# EasyEDA Pro project OMO - WayBox.eprj, board PCB1
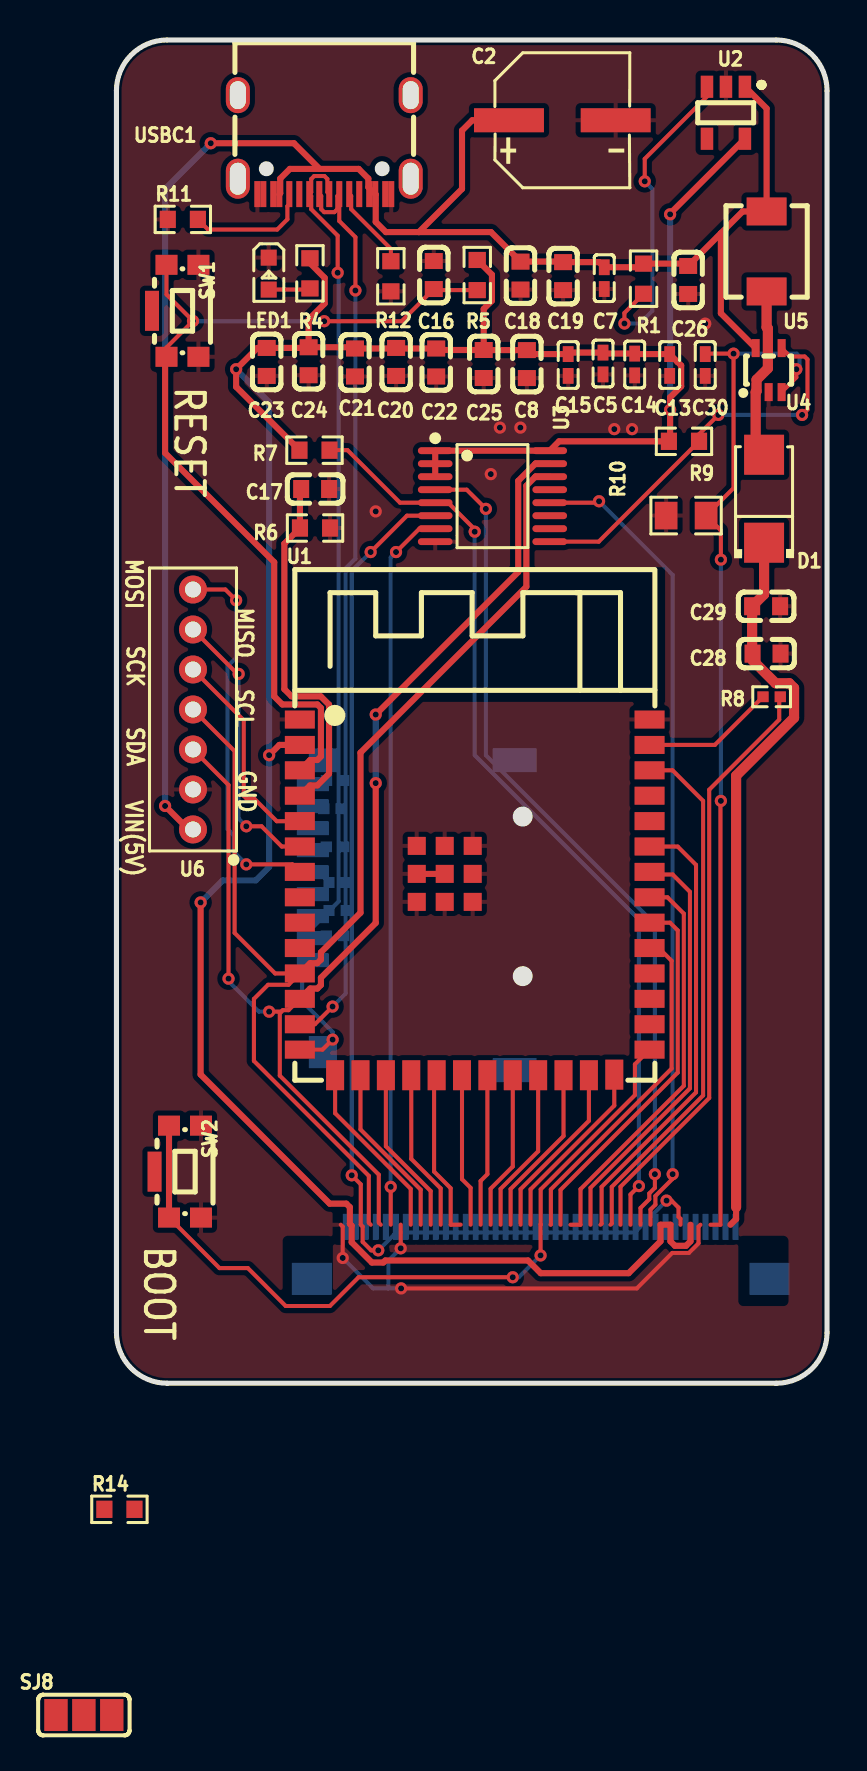
[diagram p2: board, top side]
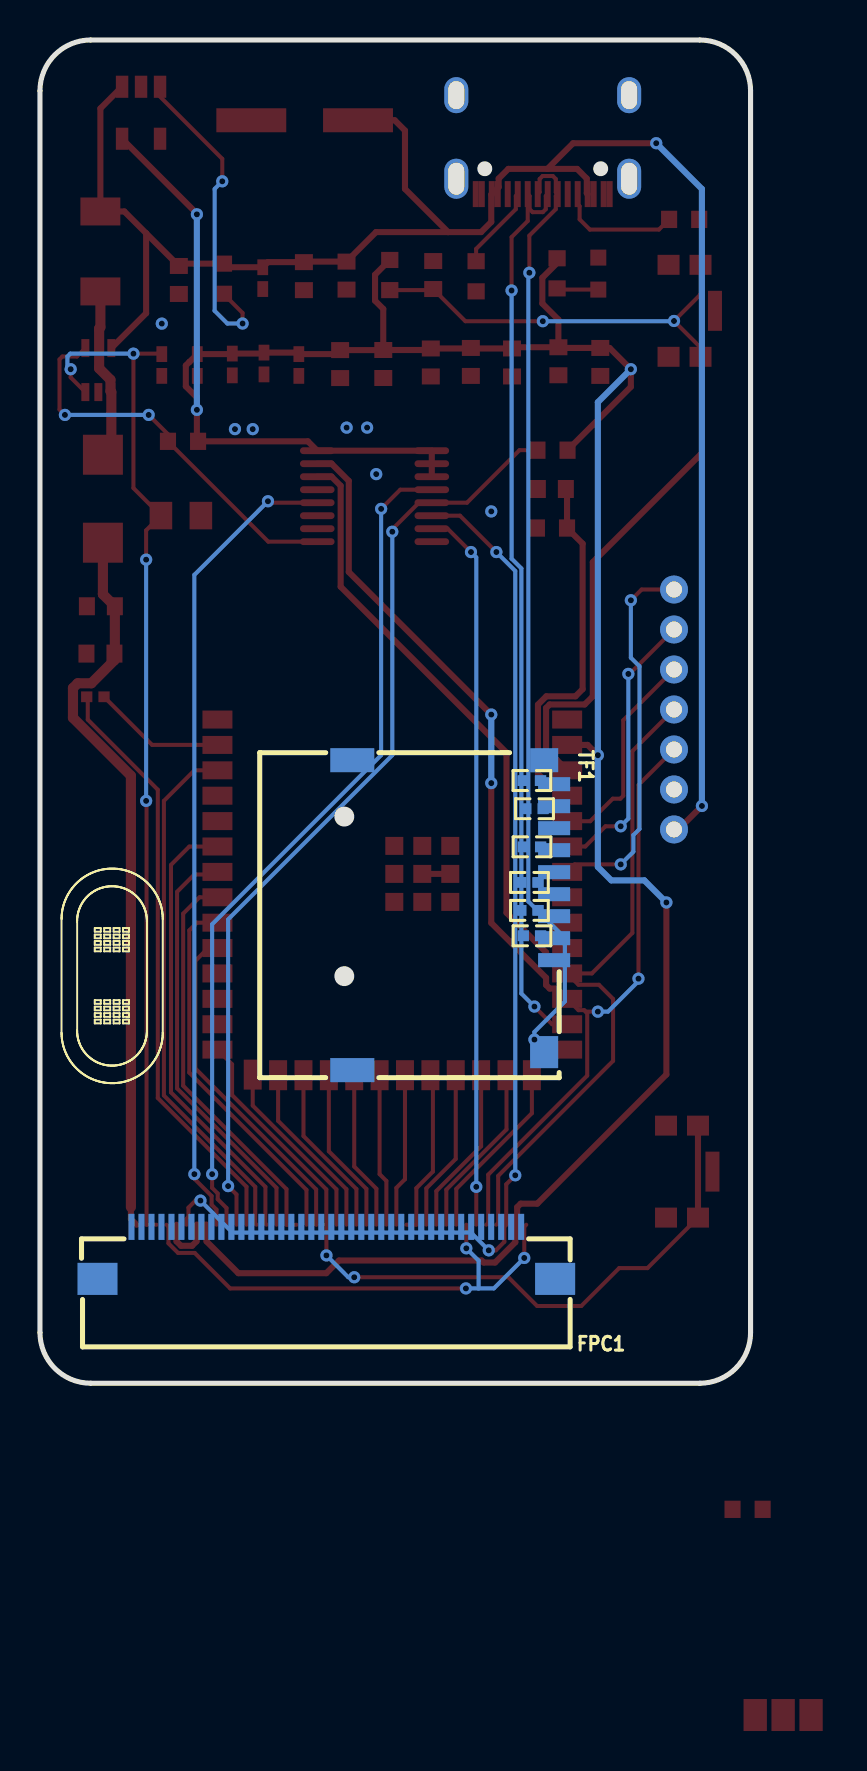
[diagram p3: board, bottom side, seen from below]

Outline 35.56 x 67.18 mm; copper layers: Top Layer, Bottom Layer. Coordinates in mm from the lower left corner of the outline.
Outline path: 0,64.64 0,2.54 arc(0.74,0.74) 2.54,0 33.02,0 arc(34.82,0.74) 35.56,2.54 35.56,64.64 arc(34.82,66.44) 33.02,67.18 2.54,67.18 arc(0.74,66.44) 0,64.64
Stack: Top Layer 0.035mm / Dielectric1 1.51mm FR4 er 4.5 / Bottom Layer 0.035mm

## Design rules (mm)
template: JLCPCB Capability(Two Layers Board)
spacing copperThickness1oz (default): track to track 0.102, other pairs 0.152 to 0.3
spacing copperThickness2oz: track to track 0.203, other pairs 0.152 to 0.3
track width copperThickness1oz (default): min 0.127, default 0.254, max 2.54
track width copperThickness2oz: min 0.203, default 0.254, max 2.54
differential pair differentialPair (default): width min 0.127, default 0.254, max 2.54; gap min 0.152, default 0.152
via viaSize (default): diameter min 0.5, default 0.61, max 10; hole min 0.3, default 0.305, max 6.3

## Placement (name value [footprint] x y rotation side)
C2  220uF  [CAP-SMD_BD6.3-L6.6-W6.6-LS7.2-FD]  22.31 63.17 0 top
C5  100nF  [C0402]  24.35 51 270 top
C7  100nF  [C0402]  24.41 55.27 270 top
C8  1uF  [C0603]  20.54 50.97 270 top
C13  100nF  [C0402]  27.69 50.93 270 top
C14  100nF  [C0402]  25.94 50.95 270 top
C15  100nF  [C0402]  22.61 50.93 270 top
C16  1uF  [C0603]  15.88 55.43 90 top
C17  1uF  [C0603]  9.94 44.73 0 top
C18  10uF  [C0603]  20.22 55.4 270 top
C19  10uF  [C0603]  22.35 55.37 270 top
C20  10uF  [C0603]  14 51.08 270 top
C21  10uF  [C0603]  11.94 51.05 270 top
C22  10uF  [C0603]  16 51.05 270 top
C23  10uF  [C0603]  7.52 51.08 270 top
C24  10uF  [C0603]  9.62 51.12 270 top
C25  10uF  [C0603]  18.38 50.98 270 top
C26  10uF  [C0603]  28.61 55.18 270 top
C28  1uF  [C0603]  32.53 36.49 0 top
C29  1uF  [C0603]  32.51 38.86 0 top
C30  100nF  [C0402]  29.46 50.93 90 top
D1  SS34  [SMA_L4.3-W2.6-LS5.2-RD]  32.41 44.24 90 top
FPC1  AFC01-S40FCA-00  [FPC-SMD_P0.50-40P_FGS-XJ-H2.0]  21.23 6.52 0 bottom
LED1  KT-0603G  [LED0603-RD]  7.62 55.5 270 top
R1  100kΩ  [R0603]  26.38 55.24 270 top
R4  10kΩ  [R0603]  9.68 55.51 90 top
R5  10kΩ  [R0603]  18.06 55.43 90 top
R6  1MΩ  [R0603]  9.94 42.77 180 top
R7  10kΩ  [R0603]  9.91 46.67 180 top
R8  100Ω  [R0402]  32.79 34.33 0 top
R9  10kΩ  [R0603]  28.4 47.11 180 top
R10  8.2Ω  [R0805]  28.51 43.4 0 top
R11  5.1kΩ  [R0603]  3.32 58.21 0 top
R12  5.1kΩ  [R0603]  13.73 55.36 270 top
R13  47kΩ  [R0402]  10.94 30.14 0 bottom
R14  10kΩ  [R0603]  0.15 -6.31 0 top
R15  47kΩ  [R0402]  10.81 28.73 0 bottom
R16  47kΩ  [R0402]  10.94 26.83 0 bottom
R17  47kΩ  [R0402]  11.07 25.05 0 bottom
R18  47kΩ  [R0402]  10.94 22.38 0 bottom
R19  47kΩ  [R0402]  11.07 23.65 0 bottom
SJ8  SOLDERJUMPER_2WAY  [SOLDERJUMPER_2WAY_OPEN_NOPASTE]  -1.63 -16.59 0 top
SW1  KMR221GLFS  [KEY-SMD_KMR2XXGXXX]  2.94 53.64 90 top
SW2  KMR221GLFS  [KEY-SMD_KMR2XXGXXX]  3.07 10.58 90 top
TF1  TF-CARD H1.8  [TF-SMD_TF-CARD-H1.8]  14.88 23.41 270 bottom
U1  ESP32-S3-WROOM-1-N16R8  [WIRELM-SMD_ESP32-S3-WROOM-1]  17.93 24.3 0 top
U2  AP2112K-3.3TRG1  [SOT-25-5_L2.9-W1.6-P0.95-LS2.8-BL]  30.5 63.54 180 top
U3  PCA9554PW,118  [TSSOP-16_L5.0-W4.4-P0.65-LS6.4-BL]  18.82 44.37 270 top
U4  TPS61169DCKR  [SC-70-5_L2.1-W1.3-P0.65-LS2.1-BR]  32.64 50.67 270 top
U5  6.8uH  [IND-SMD_L4.5-W4.1_TMPC0412HP]  32.54 56.61 90 top
U6  MF200V-11-07-0740  [CONN-TH_MF200V-11-07-0740]  3.83 33.7 90 top
USBC1  TYPE-C-31-M-12  [USB-C_SMD-TYPE-C-31-M-12]  10.4 61.95 180 top

## Footprints (pads in the part's own frame, mm; a bottom-side part is the same pattern mirrored in y, then rotated)
C0402
  rect 0.79x0.54 smd: 1(-0.545,0) 2(0.545,0)
C0603
  rect 0.8x0.9 smd: 1(-0.7,0) 2(0.7,0)
CAP-SMD_BD6.3-L6.6-W6.6-LS7.2-FD
  rect 3.5x1.2 smd: 1(-2.67,0) 2(2.67,0)
CONN-TH_MF200V-11-07-0740
  round 1.4 hole 0.8: 1(-6,0) 2(-4,0) 3(-2,0) 4(0,0) 5(2,0) 6(4,0) 7(6,0)
FPC-SMD_P0.50-40P_FGS-XJ-H2.0
  rect 0.3x1.3 smd: 1(9.75,-1.3) 2(9.25,-1.3) 3(8.75,-1.3) 4(8.25,-1.3) 5(7.75,-1.3) 6(7.25,-1.3) 7(6.75,-1.3) 8(6.25,-1.3) 9(5.75,-1.3) 10(5.25,-1.3) 11(4.75,-1.3) 12(4.25,-1.3) 13(3.75,-1.3) 14(3.25,-1.3) 15(2.75,-1.3) 16(2.25,-1.3) 17(1.75,-1.3) 18(1.25,-1.3) 19(0.75,-1.3) 20(0.25,-1.3) 21(-0.25,-1.3) 22(-0.75,-1.3) 23(-1.25,-1.3) 24(-1.75,-1.3) 25(-2.25,-1.3) 26(-2.75,-1.3) 27(-3.25,-1.3) 28(-3.75,-1.3) 29(-4.25,-1.3) 30(-4.75,-1.3) 31(-5.25,-1.3) 32(-5.75,-1.3) 33(-6.25,-1.3) 34(-6.75,-1.3) 35(-7.25,-1.3) 36(-7.75,-1.3) 37(-8.25,-1.3) 38(-8.75,-1.3) 39(-9.25,-1.3) 40(-9.75,-1.3)
  rect 2x1.6 smd: 41(-11.45,1.3) 42(11.45,1.3)
IND-SMD_L4.5-W4.1_TMPC0412HP
  rect 1.4x2 smd: 1(-2,0) 2(2,0)
KEY-SMD_KMR2XXGXXX
  rect 1x1.1 smd: 1(-2.3,0.438) 2(2.3,0.438) 3(-2.3,-1.162) 4(2.3,-1.162)
  rect 2x0.7 smd: 5(0,1.162)
LED0603-RD
  rect 0.8x0.8 smd: 1(-0.799,0) 2(0.799,0)
R0402
  rect 0.566x0.54 smd: 1(-0.433,0) 2(0.433,0)
R0603
  rect 0.806x0.864 smd: 1(-0.753,0) 2(0.753,0)
R0805
  rect 1.133x1.377 smd: 1(-1,0) 2(1,0)
SC-70-5_L2.1-W1.3-P0.65-LS2.1-BR
  rect 0.9x0.4 smd: 1(1.1,-0.65) 2(1.1,0) 3(1.1,0.65) 4(-1.1,0.65) 5(-1.1,-0.65)
SMA_L4.3-W2.6-LS5.2-RD
  rect 2x2 smd: 1(-2.2,0) 2(2.2,0)
SOLDERJUMPER_2WAY_OPEN_NOPASTE
  rect 1.169x1.6 smd: 1(-1.397,0) 2(0,0) 3(1.397,0)
SOT-25-5_L2.9-W1.6-P0.95-LS2.8-BL
  rect 0.623x1.105 smd: 1(-0.95,-1.3) 2(-0.001,-1.3) 3(0.95,-1.3) 4(0.95,1.3) 5(-0.95,1.3)
TF-SMD_TF-CARD-H1.8
  rect 0.7x1.6 smd: 1(2.25,5.05) 2(1.15,5.05) 3(0.05,5.05) 4(-1.05,5.05) 5(-2.15,5.05) 6(-3.25,5.05) 7(-4.35,5.05) 8(-5.45,5.05) 9(-6.55,5.05)
  rect 1.2x1.4 smd: 10(-7.747,4.55)
  rect 1.2x2.2 smd: 11(-7.75,-5.05) 12(7.75,-5.05)
  rect 1.6x1.4 smd: 13(6.85,4.55)
TSSOP-16_L5.0-W4.4-P0.65-LS6.4-BL
  oval 0.343x1.732 smd: 1(-2.275,-2.866) 2(-1.625,-2.866) 3(-0.975,-2.866) 4(-0.325,-2.866) 5(0.325,-2.866) 6(0.975,-2.866) 7(1.625,-2.866) 8(2.275,-2.866) 9(2.275,2.866) 10(1.625,2.866) 11(0.975,2.866) 12(0.325,2.866) 13(-0.325,2.866) 14(-0.975,2.866) 15(-1.625,2.866) 16(-2.275,2.866)
USB-C_SMD-TYPE-C-31-M-12
  oval 1.2x2 hole 0.8x1.6: 0(-4.325,1.706) 1(4.325,1.706)
  oval 1.2x1.8 hole 0.8x1.4: 2(4.325,-2.474) 3(-4.325,-2.474)
  rect 0.3x1.3 smd: A1(-3.35,2.474) A4(-2.55,2.474) A5(-1.25,2.474) A6(-0.25,2.474) A7(0.25,2.474) A8(1.25,2.474) A9(2.55,2.474) A12(3.35,2.474) B1(3.05,2.474) B4(2.25,2.474) B5(1.75,2.474) B6(0.75,2.474) B7(-0.75,2.474) B8(-1.75,2.474) B9(-2.25,2.474) B12(-3.05,2.474)
WIRELM-SMD_ESP32-S3-WROOM-1
  rect 1.5x0.9 smd: 1(-8.75,8.895) 2(-8.75,7.625) 3(-8.75,6.355) 4(-8.75,5.085) 5(-8.75,3.815) 6(-8.75,2.545) 7(-8.75,1.275) 8(-8.75,0.005) 9(-8.75,-1.265) 10(-8.75,-2.535) 11(-8.75,-3.805) 12(-8.75,-5.075) 13(-8.75,-6.345) 14(-8.75,-7.615) 27(8.75,-7.615) 28(8.75,-6.345) 29(8.75,-5.075) 30(8.75,-3.805) 31(8.75,-2.535) 32(8.75,-1.265) 33(8.75,0.005) 34(8.75,1.275) 35(8.75,2.545) 36(8.75,3.815) 37(8.75,5.085) 38(8.75,6.355) 39(8.75,7.625) 40(8.75,8.895)
  rect 0.9x1.5 smd: 15(-6.985,-8.895) 16(-5.715,-8.895) 17(-4.445,-8.895) 18(-3.175,-8.895) 19(-1.905,-8.895) 20(-0.635,-8.895) 21(0.635,-8.895) 22(1.905,-8.895) 23(3.175,-8.895) 24(4.445,-8.895) 25(5.715,-8.895) 26(6.985,-8.865)
  rect 0.9x0.9 smd: 41(-2.9,2.575) 41(-2.9,1.175) 41(-2.9,-0.225) 41(-1.5,2.575) 41(-1.5,1.175) 41(-1.5,-0.225) 41(-0.1,2.575) 41(-0.1,1.175) 41(-0.1,-0.225)

## Nets
As in the schematic, except:
3V3: C5.1 C8.1 C13.1 C14.1 C15.1 C20.1 C21.1 C22.1 C23.1 C24.1 C25.1 FPC1.5 FPC1.7 FPC1.8 FPC1.39 R4.2 R5.2 R7.2 R9.2 R13.1 R14.2 R15.1 R16.1 R17.1 R18.1 R19.1 TF1.4 U1.2 U2.5 U3.1 U3.2 U3.3 U3.16
GND: C2.2 C5.2 C7.2 C8.2 C13.2 C14.2 C15.2 C16.2 C17.2 C18.2 C19.2 C20.2 C21.2 C22.2 C23.2 C24.2 C25.2 C26.2 C28.2 C29.2 C30.1 FPC1.4 FPC1.34 FPC1.40 LED1.1 R6.1 R10.1 R11.1 R12.2 SW1.3 SW1.4 SW2.3 SW2.4 TF1.6 TF1.10 TF1.11 TF1.12 TF1.13 U1.1 U1.40 U1.41 U2.2 U3.8 U4.2 U6.2 USBC1.A1 USBC1.A12 USBC1.B1 USBC1.B12

Pads without a net: FPC1 41 42; SJ8 1 2 3; SW1 5; SW2 5; TF1 9; U1 28 29 30 36 37; U2 4; U3 10 11 13; USBC1 0 1 2 3 A8 B8

## Via types
v1: diameter 0.61, hole 0.305, Top Layer to Bottom Layer, 53 vias

## Routing (per net, layer and track width the routed paths; a pad name or vN(x,y) marks a point on that pad's centre or on a via; arc(x,y) is an arc through that point)
3V3: length 144.1
  Top Layer w0.305: C25.1 18.38,51.67 C8.1 20.74,51.47 C15.1 22.68,51.55 C5.1 24.4,51.5 C14.1 25.96,51.47 C13.1 28.08,51.08 28.08,51.08 28.26,50.9 28.26,49.86 27.71,49.31 v1(27.71,48.68) 27.71,47.17 R9.2 22.15,47.11 U3.16 U3.1 U3.2 U3.3 ; C25.1 18.38,53.73 18.79,54.14 18.79,55.44 18.06,56.18 ; C25.1 16.08,51.68 C22.1 14.02,51.75 C20.1 13.97,51.75 C21.1 11.88,51.82 C24.1 ; 28.73,7.93 28.73,7.1 28.5,6.87 27.95,6.87 27.73,7.1 27.73,7.93 27.23,7.93 27.23,7.1 25.63,5.5 21.23,5.5 20.6,6.14 13.46,6.14 13.35,6.04 12.79,6.04 11.77,7.05 11.77,7.88 11.68,7.97 11.68,8.8 11.5,8.98 10.67,8.98 4.21,15.44 v1(4.21,24.05) ; C24.1 9.58,51.78 C23.1 7.05,51.78 v1(5.99,50.72) 5.99,49.83 R7.2 ; C24.1 9.62,53.2 10.42,54 10.42,55.29 9.68,56.02 R4.2 ; v1(27.71,58.46) 27.71,58.5 U2.5 ; v1(7.64,31.41) 8.15,31.93 U1.2
  Bottom Layer w0.305: v1(5.99,50.72) 7.64,49.07 v1(7.64,31.41) 7.64,25.82 6.97,25.15 5.32,25.15 v1(4.21,24.05) ; v1(27.71,58.46) v1(27.71,48.68)
+5V: length 93.3
  Top Layer w0.305: 30.25,57.52 C26.1 28.49,56 R1.1 26.2,55.82 24.41,55.82 24.16,56.07 C19.1 22.32,56.1 C18.1 18.74,57.57 15.13,57.57 ; 30.25,57.52 31.34,58.61 U5.2 32.54,63.76 U2.1 ; 30.25,57.52 30.25,53.51 U4.5 ; 15.13,57.57 13.48,57.57 12.98,58.08 12.98,59.45 USBC1.A4 12.61,59.82 12.61,60.25 12.12,60.73 10.17,60.73 ; 15.13,57.57 17.29,59.73 17.29,62.65 17.81,63.17 C2.1 ; USBC1.B4 8.2,59.52 8.2,60.25 8.68,60.73 10.17,60.73 ; 10.17,60.73 8.88,62.02 v1(4.72,62.02) ; v1(2.43,28.87) 3.61,27.7 U6.1
  Bottom Layer w0.305: v1(4.72,62.02) 2.43,59.73 v1(2.43,28.87)
+24V: length 36.9
  Top Layer w0.305: 30.73,7.93 31.01,8.21 31.01,8.81
  Top Layer w0.508: 31.01,8.81 31.01,30.38 33.91,33.28 33.91,34.77 33.67,35.01 32.99,35.01 31.83,36.16 C28.1 31.81,36.51 C29.1 32.41,39.46 32.41,39.48 32.41,39.48 D1.1
GND: length 26.9
  Top Layer w0.203: 29.23,7.93 29.13,7.83 29.13,7 28.65,6.52 27.82,6.52 26.04,4.74 v1(14.25,4.74) ; v1(14.23,6.75) 14.23,7.93 ; v1(11.32,6.27) 11.32,7.83 11.23,7.93
  Top Layer w0.305: U1.41 15.03,25.48
  Bottom Layer w0.203: 13.61,4.74 12.85,4.74 v1(11.32,6.27) ; 13.61,4.74 13.61,6.13 v1(14.23,6.75) ; 13.61,4.74 v1(14.25,4.74)
  vias: v1(12.98,43.6) v1(18.73,45.47) v1(19.19,47.8) v1(20.21,47.8) v1(24.91,47.72) v1(25.8,47.72) v1(29.46,53)
B1: length 20.3
  Top Layer w0.203: 23.22,7.93 23.22,9.71 28.39,14.88 28.39,23.49 27.58,24.31 U1.33 ; 22.72,7.93 23.22,7.93
B2: length 18.7
  Top Layer w0.203: U1.32 27.7,23.04 28.09,22.65 28.09,15.54 22.22,9.67 22.22,7.93
B3: length 17.1
  Top Layer w0.203: 21.72,7.93 21.74,7.94 21.74,9.7 27.78,15.74 27.78,21.13 27.14,21.77 U1.31
B5: length 9.2
  Top Layer w0.203: 20.72,7.93 20.72,9.7 24.91,13.89 U1.26
BACKLIGHT: length 19.9
  Top Layer w0.203: U3.9 24.13,42.09 29.15,47.11 29.15,47.46 v1(30.12,48.43) ; v1(34.31,48.43) 34.58,48.7 34.58,51.21 34.44,51.35 33.71,51.35 U4.4
  Bottom Layer w0.203: v1(34.31,48.43) v1(30.12,48.43)
BOOT: length 38.6
  Top Layer w0.203: U1.27 25.95,15.95 25.95,14.41 21.23,9.7 21.23,7.94 21.22,7.93 v1(21.22,6.39) ; SW2.1 5.16,5.76 6.58,5.76 8.47,3.86 10.68,3.86 12.12,5.3 v1(19.83,5.3)
  Top Layer w0.305: SW2.2 SW2.1
  Bottom Layer w0.203: v1(21.22,6.39) 20.13,5.3 v1(19.83,5.3)
D+: length 48.7
  Top Layer w0.203: v1(11.07,55.54) 11.07,57.4 9.75,58.72 9.75,59.38 USBC1.B6 9.75,59.57 9.75,60.23 9.9,60.38 10.41,60.38 10.56,60.23 10.56,59.57 USBC1.A6 ; v1(10.82,17.19) 10.31,16.69 U1.14
  Bottom Layer w0.203: v1(10.82,17.19) 10.82,17.57 9.29,19.09 9.29,22.27 11.12,24.1 11.12,55.49 v1(11.07,55.54)
D-: length 46
  Top Layer w0.203: v1(10.82,18.84) 9.93,17.96 U1.13 ; USBC1.A7 10.25,59.38 10.25,58.72 10.4,58.57 10.91,58.57 11.05,58.72 11.05,59.38 USBC1.B7 11.15,58.13 11.96,57.32 v1(11.96,54.65)
  Bottom Layer w0.203: v1(11.96,54.65) 11.96,41.24 11.47,40.75 11.47,19.49 v1(10.82,18.84)
DBLTAP: length 18.3
  Top Layer w0.305: U1.4 9.69,29.9 10.05,29.9 10.64,30.49 10.64,33.94 10.22,34.36 8.76,34.36 8.4,34.71 8.4,41.99 R6.2 9.18,44.67 C17.1
DE: length 26.4
  Top Layer w0.203: 24.72,7.93 24.79,7.99 24.79,9.82 29.36,14.39 29.36,29.13 27.83,30.66 U1.38
G0: length 8.9
  Top Layer w0.203: U1.25 23.64,13.12 20.22,9.71 20.22,7.93
G1: length 8.6
  Top Layer w0.203: U1.24 22.37,12.36 19.72,9.71 19.72,7.93
G2: length 8.3
  Top Layer w0.203: U1.23 21.1,11.6 19.22,9.72 19.22,7.93
G3: length 7.9
  Top Layer w0.203: 18.72,7.93 18.72,9.73 19.83,10.84 U1.22
G4: length 7.6
  Top Layer w0.203: U1.21 18.56,10.46 18.22,10.12 18.22,7.93
G5: length 7.7
  Top Layer w0.203: U1.20 17.29,10.2 17.72,9.77 17.72,7.93
HSYNC: length 21.1
  Top Layer w0.203: U1.34 26.81,25.44 27.83,25.44 28.7,24.58 28.7,14.75 23.72,9.78 23.72,7.93
LEDK: length 51.9
  Top Layer w0.203: 29.73,7.93 30.23,7.93 30.23,29.1 v1(30.25,29.13) ; C30.2 29.49,51.49 v1(30.88,51.49) 30.88,44.77 R10.2 30.25,42.66 v1(30.25,41.19) ; 33.29,49.57 34.02,50.31 v1(34.02,50.72)
  Bottom Layer w0.203: v1(34.02,50.72) 34.18,50.88 34.18,51.35 34.04,51.49 v1(30.88,51.49) ; v1(30.25,29.13) v1(30.25,41.19)
MISO: length 14.1
  Top Layer w0.203: U1.6 8.27,26.85 7.26,27.86 v1(6.5,27.86) ; v1(6.12,35.48) 6.05,35.48 U6.6
  Bottom Layer w0.203: v1(6.12,35.48) 6.12,28.24 v1(6.5,27.86)
MOSI: length 19
  Top Layer w0.203: v1(6.5,25.95) 8.8,25.95 U1.7 ; v1(5.99,39.16) 5.45,39.7 U6.7
  Bottom Layer w0.203: v1(6.5,25.95) 5.86,26.59 5.86,27.41 5.56,27.72 5.56,35.86 5.99,36.29 v1(5.99,39.16)
PCLK: length 6.7
  Top Layer w0.203: U1.39 29.95,31.93 R8.1
R1: length 8.4
  Top Layer w0.203: U1.19 15.9,15.28 15.9,10.58 16.72,9.76 16.72,7.93 17.22,7.93
R2: length 8.1
  Top Layer w0.203: 16.23,7.93 16.23,9.75 14.75,11.22 U1.18
R3: length 8.4
  Top Layer w0.203: 15.73,7.93 15.73,9.61 13.48,11.85 U1.17
R4: length 8.7
  Top Layer w0.203: 15.23,7.93 15.23,9.68 12.21,12.69 U1.16
R5: length 9
  Top Layer w0.203: 14.73,7.93 14.73,9.72 10.94,13.51 U1.15
RESET: length 46.2
  Top Layer w0.203: R5.1 15.93,54.67 C16.1 14.27,53.12 v1(10.4,53.12) ; SW1.2 2.5,54.46 v1(3.83,53.13) 2.5,51.8 SW1.1
  Top Layer w0.305: U1.3 9.69,31.17 10.05,31.17 10.23,31.35 10.23,33.77 10.05,33.95 8.3,33.95 ; SW1.1 2.43,51.27 2.43,46.53 7.9,41.06 7.9,34.35 8.3,33.95
  Bottom Layer w0.203: v1(10.4,53.12) 3.84,53.12 v1(3.83,53.13)
SCK: length 10.7
  Top Layer w0.203: U1.5 9.17,28.11 8.02,28.11 6.9,29.24 6.51,29.24 6.37,29.38 6.37,33.16 U6.5
SCL: length 63.3
  Top Layer w0.203: U6.4 5.91,31.62 5.91,22.52 7.94,20.5 U1.11 8.61,19.93 7.59,19.93 6.88,19.22 6.88,16.12 12.63,10.37 12.63,8.02 12.73,7.93
  Top Layer w0.305: U3.14 20.97,45.34 20.51,44.89 20.51,39.84 12.21,31.54 12.21,23.53 10.23,21.55 10.23,21.19 10.05,21.01 9.69,21.01 U1.11
SDA: length 62.1
  Top Layer w0.203: 8.25,18.59 8.32,18.66 8.61,18.66 U1.12 ; 8.25,18.59 v1(7.64,18.59) ; 8.25,18.59 8.18,18.51 8.18,15.38 13.13,10.43 13.13,8.02 13.23,7.93 ; v1(5.61,20.24) 5.61,29.92 U6.3
  Top Layer w0.305: U1.12 9.69,19.74 10.05,19.74 10.23,19.92 10.23,20.28 12.98,23.02 v1(12.98,30.02) ; v1(12.98,33.44) 20.11,40.58 20.11,45.13 20.97,45.99 U3.15
  Bottom Layer w0.203: v1(5.61,20.24) 5.61,20.11 7.13,18.59 v1(7.64,18.59)
  Bottom Layer w0.305: v1(12.98,30.02) v1(12.98,33.44)
TFT_CS: length 47.3
  Top Layer w0.203: R7.1 11.56,46.67 14.19,44.04 U3.5 16.6,44.04 17.93,42.71 v1(17.93,42.59) ; v1(26.15,9.86) 25.72,9.44 25.72,7.93
  Bottom Layer w0.203: v1(26.15,9.86) 26.15,23.2 17.93,31.41 v1(17.93,42.59)
TFT_MOSI: length 40.7
  Top Layer w0.203: U3.12 24.08,44.04 v1(24.15,44.11) ; 26.73,7.93 26.73,8.69 26.97,8.93 26.97,9.37 27.83,10.23 v1(27.83,10.46)
  Bottom Layer w0.203: v1(24.15,44.11) 27.83,40.43 v1(27.83,10.46)
TFT_RESET: length 57.2
  Top Layer w0.203: v1(11.78,10.4) 12.23,9.95 12.23,7.93 12.32,7.83 12.32,7.07 12.75,6.65 v1(13.1,6.65) ; 28.23,7.93 28.23,8.23 28.13,8.32 28.13,8.78 27.78,9.13 v1(27.53,9.13) ; U3.6 14.54,43.39 v1(12.72,41.57)
  Bottom Layer w0.203: v1(11.78,10.4) 11.78,40.63 v1(12.72,41.57) ; v1(27.53,9.13) 25.93,7.54 13.99,7.54 v1(13.1,6.65)
TFT_SCK: length 42.5
  Top Layer w0.203: v1(18.49,43.73) 17.53,44.69 U3.4 ; 26.22,7.93 26.22,8.76 26.66,9.2 26.66,9.49 26.95,9.77 v1(26.95,10.46)
  Bottom Layer w0.203: v1(18.49,43.73) 18.49,31.41 26.95,22.95 v1(26.95,10.46)
TP_IRQ: length 36.2
  Top Layer w0.203: v1(13.99,41.57) 15.16,42.74 U3.7 ; 13.73,7.93 v1(13.73,9.82)
  Bottom Layer w0.203: v1(13.73,9.82) 13.73,41.31 v1(13.99,41.57)
VSYNC: length 22.7
  Top Layer w0.203: 24.22,7.93 24.28,7.98 24.28,9.82 29,14.55 29,25.92 28.09,26.84 26.68,26.84 U1.35
$1N957: length 16.3
  Top Layer w0.203: 26.38,54.49 25.42,53.53 v1(25.42,53) ; v1(26.44,60.11) 26.44,61.24 29.7,64.5 29.7,64.7 U2.3
  Bottom Layer w0.203: v1(25.42,53) 26.18,53 26.82,53.64 26.82,59.73 v1(26.44,60.11)
$1N2818: length 2.1
  Top Layer w0.203: R4.1 9.62,54.7 LED1.2
$1N5464: length 29.7
  Top Layer w0.203: R8.2 33.17,34.28 33.17,33.19 29.66,29.69 29.66,14.27 25.22,9.83 25.22,7.93
$1N6338: length 8.6
  Top Layer w0.508: U5.1 32.54,52.82 32.6,52.75 32.6,50.76 32.03,50.19 32.03,49.62 31.99,49.57 31.99,46.86 D1.2
$1N13598: length 6.2
  Top Layer w0.203: USBC1.B5 8.65,58.97 8.56,58.87 8.56,58.21 8.04,57.7 4.59,57.7 R11.2
$1N13700: length 4.2
  Top Layer w0.203: USBC1.A5 11.75,59.38 11.75,58.72 13.73,56.73 13.73,56.12

## Copper pours and planes (outline as drawn; the poured copper is in the pictures)
GND on Top Layer: -5.19,71.8 42.06,71.8 42.06,-5.54 -5.19,-5.54
(no net) on Bottom Layer: -6.58,72.12 40.66,72.12 40.66,-5.23 -6.58,-5.23

## Text on the board
Top Silkscreen Layer: MOSI | VIN(5V) | SCK | SDA | MISO | SCL | GND | BOOT | RESET
